# Altium schematic sheet Power_Supply_3.SchDoc
size A4
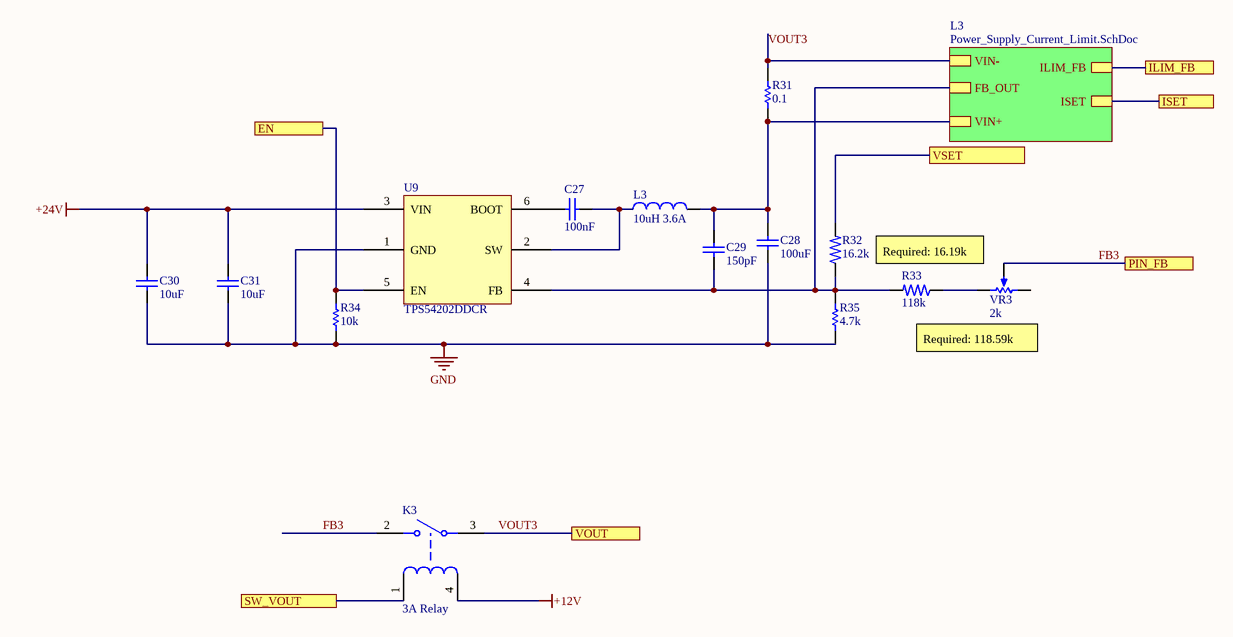
[diagram p0: Power_Supply_3.SchDoc]

## Parts
C27  100nF  [CAPC1608X09N]
C28  100uF  [PCB-qvt8zv9h5ffid452gs9x-1]
C29  150pF  [C0805]
C30  10uF  [CAPC3216X127X50ML20T25]
C31  10uF  [CAPC3216X127X50ML20T25]
K3  3A Relay  [PCB-ei6nokn2irsc2a7yt94x-1]
L3  10uH 3.6A  [PCB-aqghgth2fl3irtnr7nhi-1]
R31  0.1  [RESC3116X07M]
R32  16.2k  [PCB-3elf45qdqizoabmczrxc-1]
R33  118k  [PCB-3elf45qdqizoabmczrxc-1]
R34  10k  [gen0603-2]
R35  4.7k  [gen0603-2]
U9  TPS54202DDCR  [PCB-3e3nvufahczdahdcyxrk-1]
VR3  2k  [PCB-5abvnr99iwiiosfurk6j-1]

## Sub-sheets
L3 = Power_Supply_Current_Limit.SchDoc: VIN+, VIN-, ISET, FB_OUT, ILIM_FB

## Ports
EN, ILIM_FB, ISET, PIN_FB, SW_VOUT, VOUT, VSET

## Nets
+12V: K3.4
+24V: C30.2 C31.2 U9.3(VIN)
GND: C28.1 C30.1 C31.1 R34.2 R35.1 U9.1(GND)
EN: R34.1 U9.5(EN) ; port EN
FB3: K3.2 VR3.2(WIPER) ; port PIN_FB
ILIM_FB: port ILIM_FB, sheet L3/ILIM_FB
ISET: port ISET, sheet L3/ISET
SW_VOUT: K3.1 ; port SW_VOUT
VOUT3: K3.3 R31.1 ; port VOUT, sheet L3/VIN-
VSET: R32.2 ; port VSET
NetC27_1: C27.1 L3.1 U9.2(SW)
NetC27_2: C27.2 U9.6(BOOT)
NetC28_2: C28.2 C29.2 L3.2 R31.2 ; sheet L3/VIN+
NetC29_1: C29.1 R32.1 R33.2 R35.2 U9.4(FB) ; sheet L3/FB_OUT
NetR33_1: R33.1 VR3.1(CCW)

Not connected (* = marked no-connect by the designer): VR3 3(CW)

## Notes on the sheet
- (near VR3) Required: 16.19k
- Required: 118.59k

## Library data of the parts
C27 = CMP-2f55e5122ad9f092-5: 0603 10 nF 50 V ± 10% Tolerance X7R Surface Mount Multilayer Ceramic Capacitor; Manufacture Part Number: CC0603KRX7R9BB104; Manufacturer: YAGEO; Voltage-Rated: 50V; Capacitance Tolerance: 10%; Capacitance: 100nF; Package / Case: 0603; Supplier: LCSC; Supplier Part Number: C14663
C28 = CMP-37c1fb270af2e806-1: Footprint for Rubycon 50YXF100MFFC8X11.5; Capacitance Tolerance: 20%; Voltage Rated: 50V; Manufacture Part Number: 50YXF100MFFC8X11.5; Capacitance: 100uF; Manufacturer: Rubycon; Package / Case: *; Supplier: LCSC; Supplier Part Number: C324036
C29 = CMP-135114-3: Cap Ceramic 0.1uF 50V X7R 10% SMD 0805 125C Embossed T/R; Manufacture Part Number: CC0805JRNPO9BN151; Manufacturer: YAGEO; Capacitance Tolerance: 5%; Package / Case: 0805; Capacitance: 150pF; Supplier: LCSC; Supplier Part Number: C107111; Voltage-Rated: 50V
C30 = CMP-126371-4: CAP CER 0.1UF 100V 10% X7R 1206; Manufacturer: Samsung Electro-Mechanics; Manufacture Part Number: CL31B106KBHNNNE; Voltage-Rated: 50V; Supplier: LCSC; Capacitance: 10uF; Package / Case: 1206; Capacitance Tolerance: 10%; Supplier Part Number: C89632
C31 = CMP-126371-4: CAP CER 0.1UF 100V 10% X7R 1206; Manufacture Part Number: CL31B106KBHNNNE; Manufacturer: Samsung Electro-Mechanics; Voltage-Rated: 50V; Supplier: LCSC; Capacitance: 10uF; Package / Case: 1206; Capacitance Tolerance: 10%; Supplier Part Number: C89632
K3 = CMP-edc624afa9603201-3: Power Relay 12VDC 3DC/5AAC SPST-NO( (20.5mm 7.2mm 15.3mm)) THT; Manufacturer: Omron Electronics; Manufacture Part Number: G5NB-1A-E-DC12; Supplier: LCSC; Supplier Part Number: C225714; Current-Rated: 3A
L3 = CMP-8deb4183ed4a522c-1: Inductor Power Shielded Wirewound 10uH 20% 100KHz Metal 4.2A 86.35mOhm DCR Automotive T/R; Manufacture Part Number: SPM6530T-100M-HZ; Manufacturer: TDK; Octopart URL: https://octopart.com/spm6530t-100m-hz-tdk-90326471; OctopartID: 8deb4183ed4a522c; Supplier: LCSC; Supplier Part Number: C360728
R31 = CMP-90ca5a8d69034f0d-5: Res Thick Film 3.2 x 1.6 mm 10K Ohm 1% 0.25W(1/4W) 100ppm/ C Molded SMD Paper T/R; Manufacture Part Number: 1206W4F100LT5E; Manufacturer: UNI-ROYAL(Uniroyal Elec); Package / Case: 1206; Resistance: 0.1; Resistance Tolerance: 1%; Supplier: LCSC; Supplier Part Number: C25334
R32 = CMP-1853278-23: Surface Mount Thick Film Resistor, RC Series, 1 kohm, 100 mW, - 1%, 50 V, 0603 [1608 Metric]; Manufacturer: UNI-ROYAL(Uniroyal Elec); Manufacture Part Number: 0603WAF1622T5E; Resistance Tolerance: 1%; Package / Case: 0603; Resistance: 16.2k; Supplier: LCSC; Supplier Part Number: C22885
R33 = CMP-1853278-23: Surface Mount Thick Film Resistor, RC Series, 1 kohm, 100 mW, - 1%, 50 V, 0603 [1608 Metric]; Manufacturer: UNI-ROYAL(Uniroyal Elec); Manufacture Part Number: 0603WAF1183T5E; Resistance Tolerance: 1%; Package / Case: 0603; Resistance: 118k; Supplier: LCSC; Supplier Part Number: C25806
R34 = CMP-1853278-27: Surface Mount Thick Film Resistor, RC Series, 1 kohm, 100 mW, - 1%, 50 V, 0603 [1608 Metric]; Manufacturer: YAGEO; Manufacture Part Number: RC0603FR-0710KL; Resistance Tolerance: 1%; Supplier: LCSC; Supplier Part Number: C98220; Resistance: 10k; Package / Case: 0603
R35 = CMP-1853278-27: Surface Mount Thick Film Resistor, RC Series, 1 kohm, 100 mW, - 1%, 50 V, 0603 [1608 Metric]; Manufacture Part Number: RC0603FR-074K7L; Manufacturer: YAGEO; Package / Case: 0603; Resistance: 4.7k; Resistance Tolerance: 1%; Supplier: LCSC; Supplier Part Number: C99782
U9 = CMP-793bb472c98da6fc-1: Conv DC-DC 4.5V to 28V Synchronous Step Down Single-Out -0.1V to 28V 2A 6-Pin TSOT-23 T/R; Manufacturer: Texas Instruments; Manufacture Part Number: TPS54202DDCR; Supplier: LCSC; Supplier Part Number: C191884
VR3 = CMP-a8df61d7bf077718-3: Res Cermet Trimmer 2K Ohm 10% 1/2W 25(Elec)Turn 2.19mm (9.53 X 4.83 X 11.55mm) Pin Thru-Hole Tube; Manufacture Part Number: 3296W-1-202; Manufacturer: BOCHEN(Chengdu Guosheng Tech); Power Rating: 500 mW; Size-Height: 10.0 mm; Supplier Part Number: C118206; Supplier: LCSC; Resistance: 2k